# Altium schematic sheet chopper.SchDoc
size A
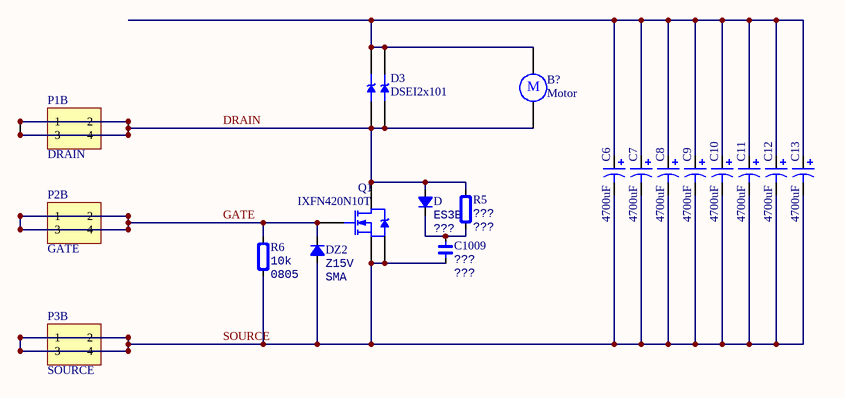
[diagram p0: chopper.SchDoc]

## Parts
B?  Motor  (graphical)
C6  value 4700uF  (graphical)
C7  value 4700uF  (graphical)
C8  value 4700uF  (graphical)
C9  value 4700uF  (graphical)
C10  value 4700uF  (graphical)
C11  value 4700uF  (graphical)
C12  value 4700uF  (graphical)
C13  value 4700uF  (graphical)
C1009  ???
D  Type: ???  [DSO-C2/X2.3]  (hidden comment: ES3B)
D3  DSEI2x101  [SOT-227B]
DZ2  Type: SMA  [DSO-C2/X2.3]  (hidden comment: Z15V)
P1B  DRAIN  [HDR2X2]
P2B  GATE  [HDR2X2]
P3B  SOURCE  [HDR2X2]
Q1  IXFN420N10T  [SOT-227B]
R5  ???  [0805R]
R6  Type: 0805  [0805R]  (hidden comment: 10k)

## Nets
DRAIN: B?.2 D.1(A) D3.2(A1) D3.3(A2) P1B.1 P1B.2 P1B.3 P1B.4 Q1.3(D) R5.1
GATE: DZ2.2(K) P2B.1 P2B.2 P2B.3 P2B.4 Q1.2(G) R6.1
SOURCE: C6.2 C7.2 C8.2 C9.2 C10.2 C11.2 C12.2 C13.2 C1009.1 DZ2.1(A) P3B.1 P3B.2 P3B.3 P3B.4 Q1.1(S) Q1.4(S) R6.2
NetB?_1: B?.1 C6.1 C7.1 C8.1 C9.1 C10.1 C11.1 C12.1 C13.1 D3.1(K1) D3.4(K2)
NetC1009_2: C1009.2 D.2(K) R5.2

## Notes on the sheet
- (in symbol Motor) M

## Library data of the parts
B? = Motor: Motor, General Kind
C6-C13 = Cap Pol1: Polarized Capacitor (Radial)
C1009 = Cap_0805: Capacitor; Value: ???; Type: ???
D DZ2 = Diode_SMA: Diode
  D: Value: ES3B
  DZ2: Value: Z15V
P1B P2B P3B = Header 2X2: Header, 2-Pin, Dual row; LatestRevisionDate: 17-Jul-2002; LatestRevisionNote: Re-released for DXP Platform.; Publisher: Altium Limited
R5 R6 = Res_0805: Resistor
  R5: Value: ???; Type: ???
  R6: Value: 10k